# Altium schematic sheet MQ6.SchDoc
size A
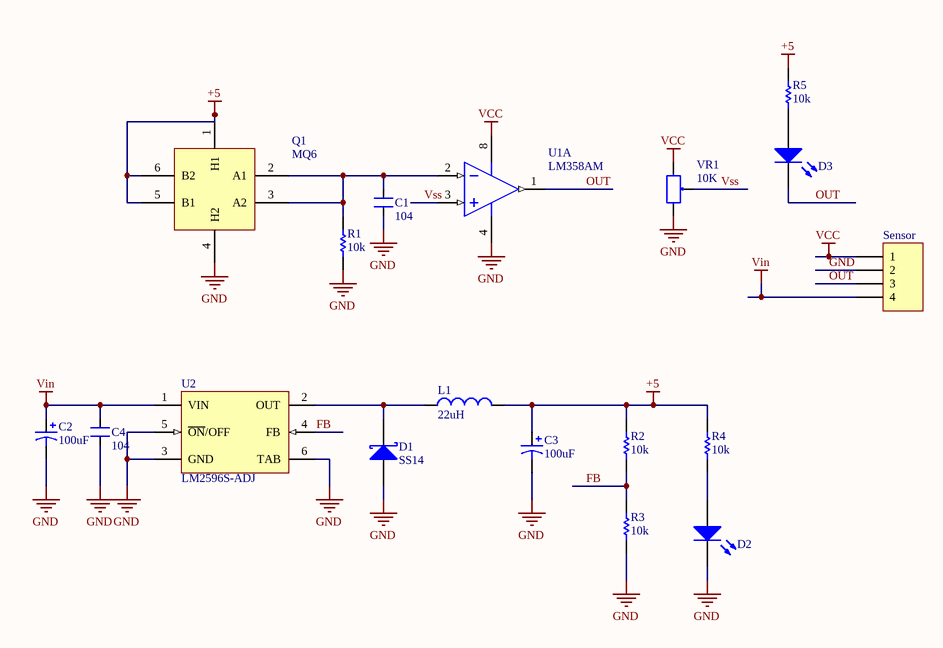
[diagram p0: MQ6.SchDoc]

## Parts
C1  value 104  [SMD 0603]  (hidden comment: CAP NP)
C2  value 100uF  [SMD CAP 7x7]  (hidden comment: Cap)
C3  value 100uF  [SMD CAP 7x7]  (hidden comment: Cap)
C4  value 104  [SMD 0603]  (hidden comment: CAP NP)
D1  SS14  [SS14]
D2  Led  [Led 0805]  (value not drawn)
D3  Led  [Led 0805]  (value not drawn)
L1  value 22uH  [Inductor C8x10]  (hidden comment: Inductor)
Q1  MQ6  [MQ6]
R1  value 10k  [SMD 0603]  (hidden comment: Res)
R2  value 10k  [SMD 0603]  (hidden comment: Res)
R3  value 10k  [SMD 0603]  (hidden comment: Res)
R4  value 10k  [SMD 0603]  (hidden comment: Res)
R5  value 10k  [SMD 0603]  (hidden comment: Res)
Sensor  Header 4  [HDR1X4]  (value not drawn)
U1  LM358AM  [M08A_N]  (part A of 2)
U2  LM2596S-ADJ  [TS5B_N]
VR1  10K  [VR1]

## Nets
+5: C3.1 L1.2 Q1.1(H1) Q1.5(B1) Q1.6(B2) R2.2 R4.2 R5.2
GND: C1.1 C2.2 C3.2 C4.1 D1.1(A) D2.2(K) Q1.4(H2) R1.1 R3.1 Sensor.2 U1.4(GND) U2.3(GND) U2.5(~{ON}/OFF) U2.6(TAB) VR1.3
VCC: Sensor.1 U1.8(V+) VR1.1
Vin: C2.1 C4.2 Sensor.4 U2.1(VIN)
FB: R2.1 R3.2 U2.4(FB)
OUT: D3.2(K) Sensor.3 U1.1(OUTA)
Vss: U1.3(INA+) VR1.2
NetC1_2: C1.2 Q1.2(A1) Q1.3(A2) R1.2 U1.2(INA-)
NetD1_2: D1.2(K) L1.1 U2.2(OUT)
NetD2_1: D2.1(A) R4.1
NetD3_1: D3.1(A) R5.1

## Library data of the parts
D1 = Diode Schottky
Sensor = Header 4: Header, 4-Pin; LatestRevisionDate: 17-Jul-2002; LatestRevisionNote: Re-released for DXP Platform.; Publisher: Altium Limited
U1 = LM358AM: Low Power Dual Operational Amplifier; Manufacturer: National Semiconductor; CompType: Amplifiers; PackageTopMarking: NSZXTT*LM*358AM; PowerWise: N; Published: 4-Dec-2008; LatestRevisionDate: 13-Jan-2009; LatestRevisionNote: Sim Model Added.; DatasheetVersion: Oct-2005; PackageVersion: revL, Sep-2006; PackageReference: M08A; Publisher: Altium Limited; PackageDescription: SOIC Narrow, 4.9 x 3.9 x 1.45mm, 8 Lead, 1.27mm Pitch; PartNumber: LM358AM; RoHS: O; PinCount: 8; DigiKeyPartNumber: LM358AMXCT-ND; Code_JEDEC: MS-012-AA; Code_IPC: SOIC127P600-8; ComponentLink1Description: LM358 Datasheet; ComponentLink1URL: http://www.national.com/ds/LM/LM358.pdf; ComponentLink2Description: LM358 Web Page; ComponentLink2URL: http://www.national.com/pf/LM/LM358.html; ComponentLink3Description: M08A Package Page; ComponentLink3URL: http://www.national.com/packaging/folders/m08a.html
U2 = LM2596S-ADJ: SIMPLE SWITCHER Power Converter 150 KHz 3A Step-Down Voltage Regulator; Manufacturer: National Semiconductor; PackageTopMarking: NSUZXYTT*LM2596S*-ADJ P+; PowerWise: N; FirstPublished: 4-Dec-2008; DatasheetVersion: May-2002; PackageVersion: revD, Apr-2005; PackageReference: TS5B; Publisher: Altium Limited; PackageDescription: TO-263, Molded, .400 x .390 x .180in, 5 Lead, .067in Pitch, Surface Mount; CompType: Switcher; PartNumber: LM2596S-ADJ; RoHS: O; PinCount: 5; DigiKeyPartNumber: LM2596S-ADJ-ND; Code_JEDEC: MO-169-AB; ComponentLink1Description: LM2596 Datasheet; ComponentLink1URL: http://www.national.com/ds/LM/LM2596.pdf; ComponentLink2Description: LM2596 Web Page; ComponentLink2URL: http://www.national.com/pf/LM/LM2596.html; ComponentLink3Description: TS5B Package Page; ComponentLink3URL: http://www.national.com/packaging/folders/ts5b.html
VR1 = VR: Var Resistor; Value: VR 10K